# Altium schematic sheet USB2XXX (1).SchDoc
size A3
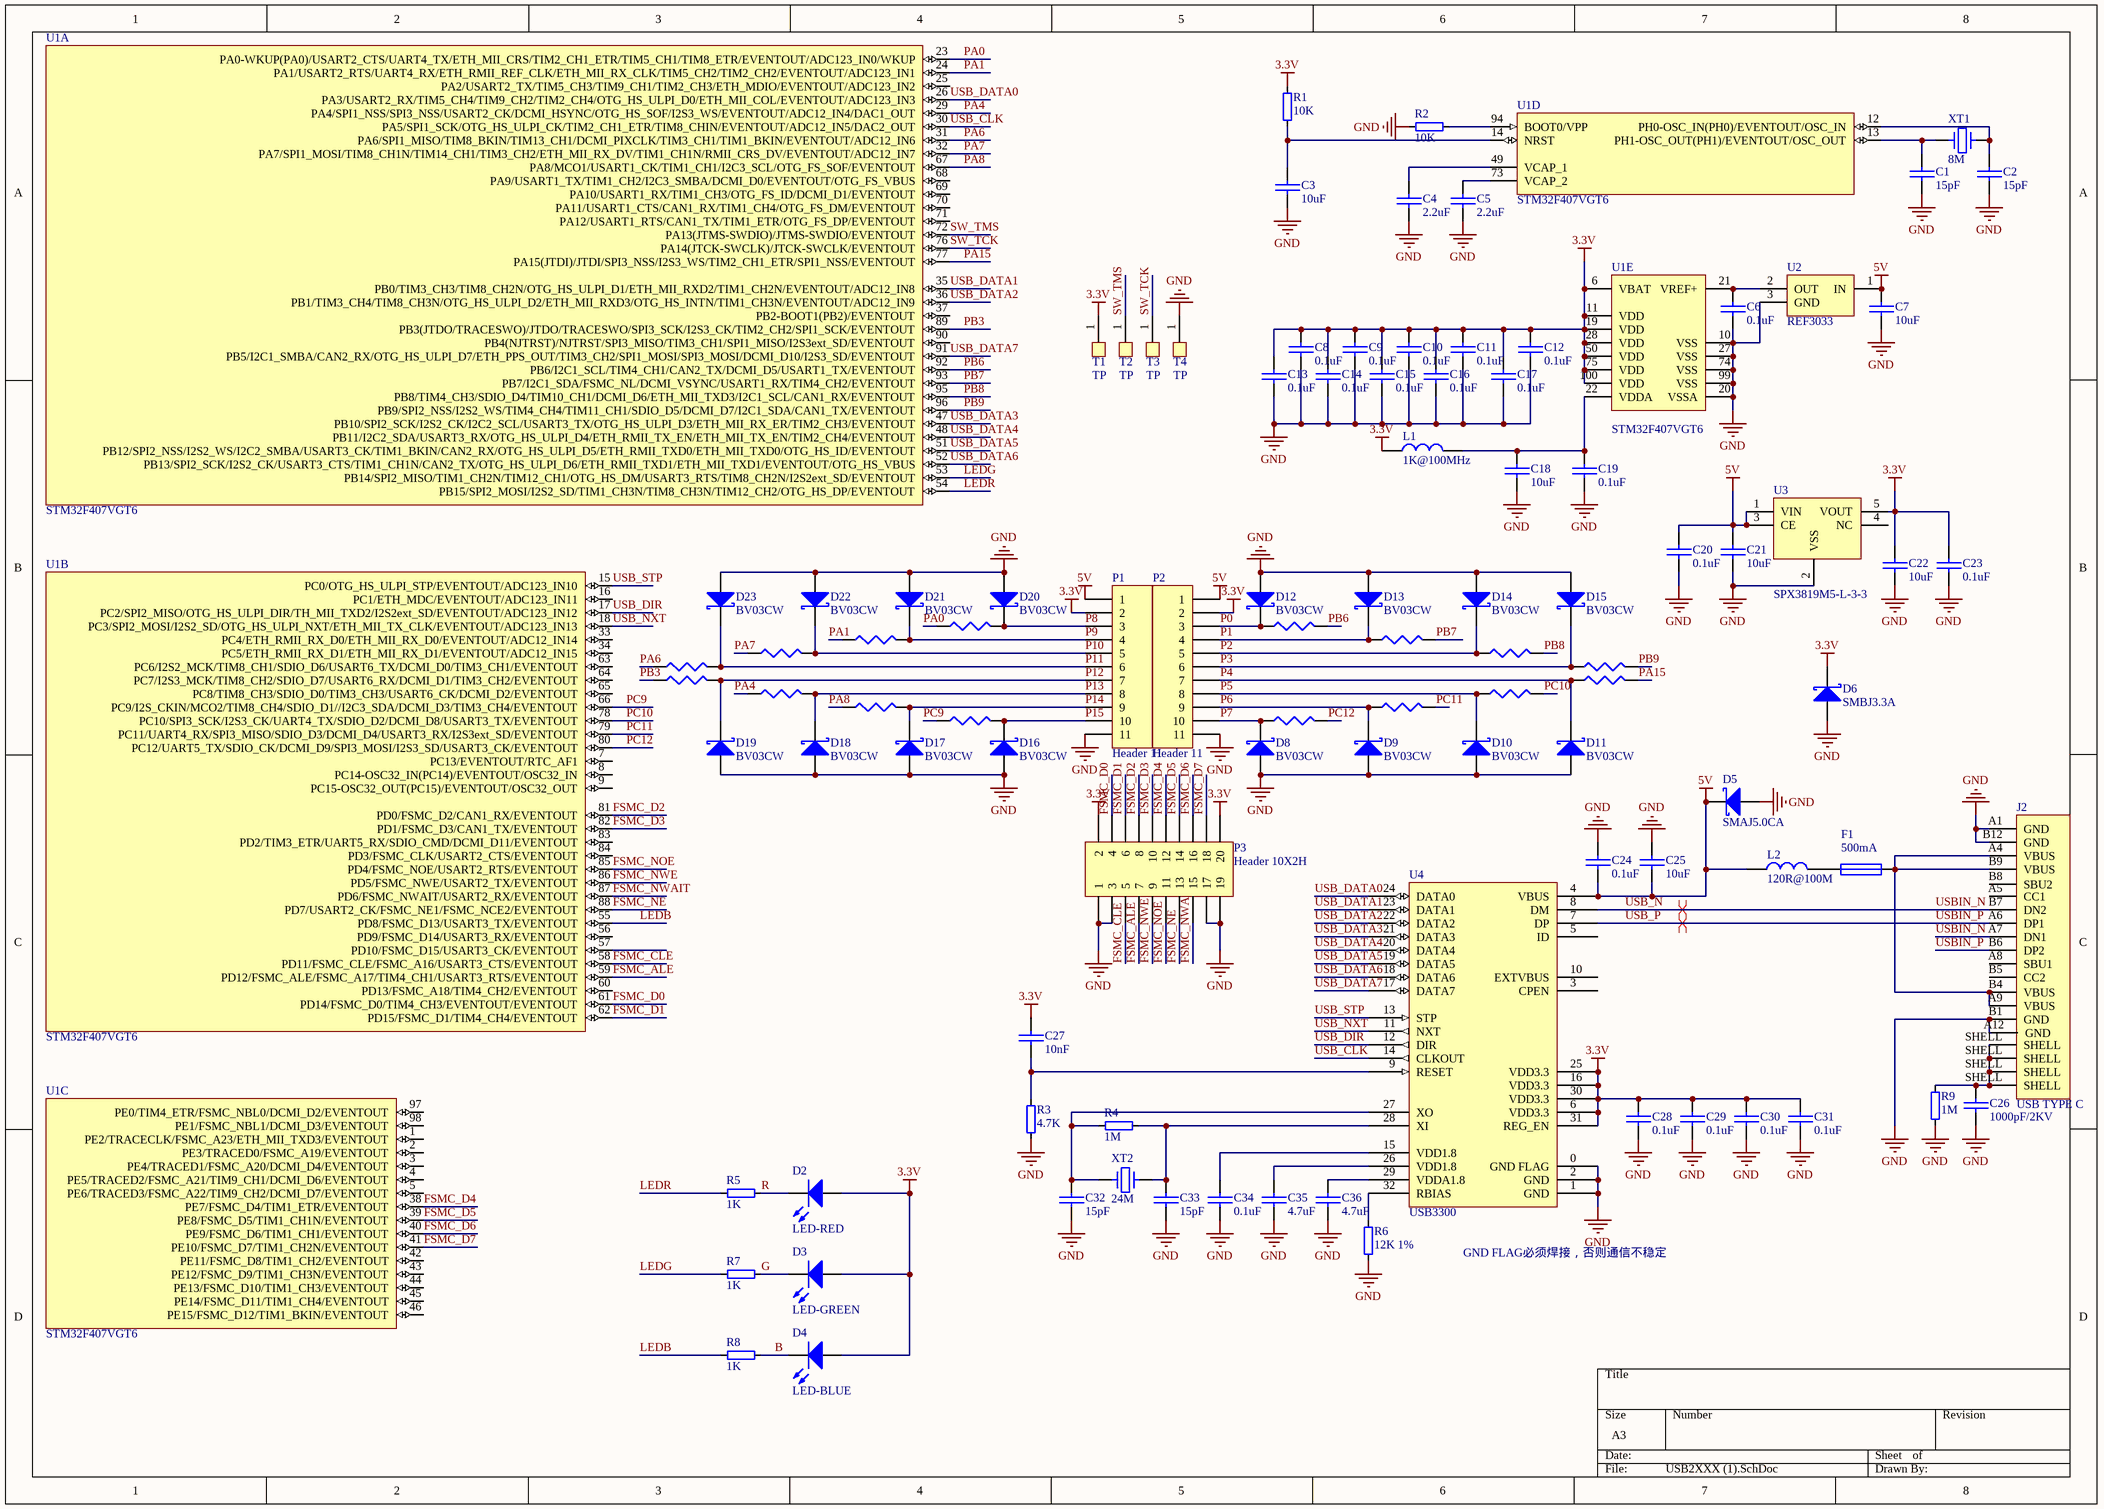
[diagram p0: USB2XXX (1).SchDoc]

## Parts
C1  15pF  [C0402]
C2  15pF  [C0402]
C3  10uF  [C0603]
C4  2.2uF  [C0402]
C5  2.2uF  [C0402]
C6  0.1uF  [C0402]
C7  10uF  [C0603]
C8  0.1uF  [C0402]
C9  0.1uF  [C0402]
C10  0.1uF  [C0402]
C11  0.1uF  [C0402]
C12  0.1uF  [C0402]
C13  0.1uF  [C0402]
C14  0.1uF  [C0402]
C15  0.1uF  [C0402]
C16  0.1uF  [C0402]
C17  0.1uF  [C0402]
C18  10uF  [C0603]
C19  0.1uF  [C0402]
C20  0.1uF  [C0402]
C21  10uF  [C0603]
C22  10uF  [C0603]
C23  0.1uF  [C0402]
C24  0.1uF  [C0402]
C25  10uF  [C0603]
C26  1000pF/2KV  [C1206]
C27  10nF  [C0402]
C28  0.1uF  [C0402]
C29  0.1uF  [C0402]
C30  0.1uF  [C0402]
C31  0.1uF  [C0402]
C32  15pF  [C0402]
C33  15pF  [C0402]
C34  0.1uF  [C0402]
C35  4.7uF  [C0402]
C36  4.7uF  [C0402]
D2  LED-RED  [LED0603R]
D3  LED-GREEN  [LED0603G]
D4  LED-BLUE  [LED0603B]
D5  SMAJ5.0CA  [DO-214AC]
D6  SMBJ3.3A  [DO-214AA]
D8  BV03CW  [SOD323]
D9  BV03CW  [SOD323]
D10  BV03CW  [SOD323]
D11  BV03CW  [SOD323]
D12  BV03CW  [SOD323]
D13  BV03CW  [SOD323]
D14  BV03CW  [SOD323]
D15  BV03CW  [SOD323]
D16  BV03CW  [SOD323]
D17  BV03CW  [SOD323]
D18  BV03CW  [SOD323]
D19  BV03CW  [SOD323]
D20  BV03CW  [SOD323]
D21  BV03CW  [SOD323]
D22  BV03CW  [SOD323]
D23  BV03CW  [SOD323]
F1  500mA  [R0805]
J2  USB TYPE C  [USB3.1_16P]
L1  1K@100MHz  [R0603]
L2  120R@100M  [R0603]
P1  Header 11  [HDR1X11]
P2  Header 11  [HDR1X11]
P3  Header 10X2H  [HDR2X10]
R1  10K  [R0402]
R2  10K  [R0402]
R3  4.7K  [R0402]
R4  1M  [R0402]
R5  1K  [R0402]
R6  12K 1%  [R0402]
R7  1K  [R0402]
R8  1K  [R0402]
R9  1M  [R0402]
R10  0R  [R0402]  (value not drawn)
R11  0R  [R0402]  (value not drawn)
R12  0R  [R0402]  (value not drawn)
R13  0R  [R0402]  (value not drawn)
R14  0R  [R0402]  (value not drawn)
R15  0R  [R0402]  (value not drawn)
R16  0R  [R0402]  (value not drawn)
R17  0R  [R0402]  (value not drawn)
R18  0R  [R0402]  (value not drawn)
R19  0R  [R0402]  (value not drawn)
R20  0R  [R0402]  (value not drawn)
R21  0R  [R0402]  (value not drawn)
R22  0R  [R0402]  (value not drawn)
R23  0R  [R0402]  (value not drawn)
R24  0R  [R0402]  (value not drawn)
R25  0R  [R0402]  (value not drawn)
T1  TP  [TP15]
T2  TP  [TP15]
T3  TP  [TP15]
T4  TP  [TP15]
U1  STM32F407VGT6  [TQFP-100]  (parts A,B,C,D,E of 5)
U2  REF3033  [SOT-23]
U3  SPX3819M5-L-3-3  [SOT23-5]
U4  USB3300  [QFN50P500X500X100-32N]
XT1  8M  [CRYSTAL-SMD-5032]
XT2  24M  [CRYSTAL-SMD-5032]

## Nets
3.3V: C8.2 C9.2 C10.2 C11.2 C12.2 C13.2 C14.2 C15.2 C16.2 C17.2 C22.2 C23.2 C27.2 C28.2 C29.2 C30.2 C31.2 D2.1(A) D3.1(A) D4.1(A) D6.2(K) L1.1 P1.2 P2.2 P3.2 P3.20 R1.2 T1.1 U1.6(VBAT) U1.11(VDD) U1.19(VDD) U1.28(VDD) U1.50(VDD) U1.75(VDD) U1.100(VDD) U3.5(VOUT) U4.6(VDD3.3) U4.16(VDD3.3) U4.25(VDD3.3) U4.30(VDD3.3) U4.31(REG_EN)
5V: C7.2 C20.2 C21.1 C24.1 C25.1 D5.2(K) L2.1 P1.1 P2.1 U2.1(IN) U3.1(VIN) U3.3(CE) U4.4(VBUS)
GND: C1.1 C2.1 C3.1 C4.1 C5.1 C6.1 C7.1 C8.1 C9.1 C10.1 C11.1 C12.1 C13.1 C14.1 C15.1 C16.1 C17.1 C18.1 C19.1 C20.1 C21.2 C22.1 C23.1 C24.2 C25.2 C26.2 C28.1 C29.1 C30.1 C31.1 C32.1 C33.1 C34.1 C35.1 C36.1 D5.1(A) D6.1(A) D8.1(A) D9.1(A) D10.1(A) D11.1(A) D12.1(A) D13.1(A) D14.1(A) D15.1(A) D16.1(A) D17.1(A) D18.1(A) D19.1(A) D20.1(A) D21.1(A) D22.1(A) D23.1(A) J2.A1(GND) J2.A12(GND) J2.B1(GND) J2.B12(GND) P1.11 P2.11 P3.1 P3.3 P3.17 P3.19 R2.1 R3.1 R6.1 R9.1 T4.1 U1.10(VSS) U1.20(VSSA) U1.27(VSS) U1.74(VSS) U1.99(VSS) U2.3(GND) U3.2(VSS) U4.0(GND_FLAG) U4.1(GND) U4.2(GND)
B: D4.2(K) R8.2
FSMC_ALE: P3.7 U1.59(PD12/FSMC_ALE/FSMC_A17/TIM4_CH1/USART3_RTS/EVENTOUT)
FSMC_CLE: P3.5 U1.58(PD11/FSMC_CLE/FSMC_A16/USART3_CTS/EVENTOUT)
FSMC_D0: P3.4 U1.61(PD14/FSMC_D0/TIM4_CH3/EVENTOUT/EVENTOUT)
FSMC_D1: P3.6 U1.62(PD15/FSMC_D1/TIM4_CH4/EVENTOUT)
FSMC_D2: P3.8 U1.81(PD0/FSMC_D2/CAN1_RX/EVENTOUT)
FSMC_D3: P3.10 U1.82(PD1/FSMC_D3/CAN1_TX/EVENTOUT)
FSMC_D4: P3.12 U1.38(PE7/FSMC_D4/TIM1_ETR/EVENTOUT)
FSMC_D5: P3.14 U1.39(PE8/FSMC_D5/TIM1_CH1N/EVENTOUT)
FSMC_D6: P3.16 U1.40(PE9/FSMC_D6/TIM1_CH1/EVENTOUT)
FSMC_D7: P3.18 U1.41(PE10/FSMC_D7/TIM1_CH2N/EVENTOUT)
FSMC_NE: P3.13 U1.88(PD7/USART2_CK/FSMC_NE1/FSMC_NCE2/EVENTOUT)
FSMC_NOE: P3.11 U1.85(PD4/FSMC_NOE/USART2_RTS/EVENTOUT)
FSMC_NWAIT: P3.15 U1.87(PD6/FSMC_NWAIT/USART2_RX/EVENTOUT)
FSMC_NWE: P3.9 U1.86(PD5/FSMC_NWE/USART2_TX/EVENTOUT)
G: D3.2(K) R7.2
LEDB: R8.1 U1.55(PD8/FSMC_D13/USART3_TX/EVENTOUT)
LEDG: R7.1 U1.53(PB14/SPI2_MISO/TIM1_CH2N/TIM12_CH1/OTG_HS_DM/USART3_RTS/TIM8_CH2N/I2S2ext_SD/EVENTOUT)
LEDR: R5.1 U1.54(PB15/SPI2_MOSI/I2S2_SD/TIM1_CH3N/TIM8_CH3N/TIM12_CH2/OTG_HS_DP/EVENTOUT)
P0: D12.2(K) P2.3 R18.1
P1: D13.2(K) P2.4 R19.1
P2: D14.2(K) P2.5 R20.1
P3: D15.2(K) P2.6 R21.1
P4: D11.2(K) P2.7 R22.1
P5: D10.2(K) P2.8 R23.1
P6: D9.2(K) P2.9 R24.1
P7: D8.2(K) P2.10 R25.1
P8: D20.2(K) P1.3 R10.2
P9: D21.2(K) P1.4 R11.2
P10: D22.2(K) P1.5 R12.2
P11: D23.2(K) P1.6 R13.2
P12: D19.2(K) P1.7 R14.2
P13: D18.2(K) P1.8 R15.2
P14: D17.2(K) P1.9 R16.2
P15: D16.2(K) P1.10 R17.2
PA0: R10.1 U1.23(PA0-WKUP(PA0)/USART2_CTS/UART4_TX/ETH_MII_CRS/TIM2_CH1_ETR/TIM5_CH1/TIM8_ETR/EVENTOUT/ADC123_IN0/WKUP)
PA1: R11.1 U1.24(PA1/USART2_RTS/UART4_RX/ETH_RMII_REF_CLK/ETH_MII_RX_CLK/TIM5_CH2/TIM2_CH2/EVENTOUT/ADC123_IN1)
PA4: R15.1 U1.29(PA4/SPI1_NSS/SPI3_NSS/USART2_CK/DCMI_HSYNC/OTG_HS_SOF/I2S3_WS/EVENTOUT/ADC12_IN4/DAC1_OUT)
PA6: R13.1 U1.31(PA6/SPI1_MISO/TIM8_BKIN/TIM13_CH1/DCMI_PIXCLK/TIM3_CH1/TIM1_BKIN/EVENTOUT/ADC12_IN6)
PA7: R12.1 U1.32(PA7/SPI1_MOSI/TIM8_CH1N/TIM14_CH1/TIM3_CH2/ETH_MII_RX_DV/TIM1_CH1N/RMII_CRS_DV/EVENTOUT/ADC12_IN7)
PA8: R16.1 U1.67(PA8/MCO1/USART1_CK/TIM1_CH1/I2C3_SCL/OTG_FS_SOF/EVENTOUT)
PA15: R22.2 U1.77(PA15(JTDI)/JTDI/SPI3_NSS/I2S3_WS/TIM2_CH1_ETR/SPI1_NSS/EVENTOUT)
PB3: R14.1 U1.89(PB3(JTDO/TRACESWO)/JTDO/TRACESWO/SPI3_SCK/I2S3_CK/TIM2_CH2/SPI1_SCK/EVENTOUT)
PB6: R18.2 U1.92(PB6/I2C1_SCL/TIM4_CH1/CAN2_TX/DCMI_D5/USART1_TX/EVENTOUT)
PB7: R19.2 U1.93(PB7/I2C1_SDA/FSMC_NL/DCMI_VSYNC/USART1_RX/TIM4_CH2/EVENTOUT)
PB8: R20.2 U1.95(PB8/TIM4_CH3/SDIO_D4/TIM10_CH1/DCMI_D6/ETH_MII_TXD3/I2C1_SCL/CAN1_RX/EVENTOUT)
PB9: R21.2 U1.96(PB9/SPI2_NSS/I2S2_WS/TIM4_CH4/TIM11_CH1/SDIO_D5/DCMI_D7/I2C1_SDA/CAN1_TX/EVENTOUT)
PC9: R17.1 U1.66(PC9/I2S_CKIN/MCO2/TIM8_CH4/SDIO_D1//I2C3_SDA/DCMI_D3/TIM3_CH4/EVENTOUT)
PC10: R23.2 U1.78(PC10/SPI3_SCK/I2S3_CK/UART4_TX/SDIO_D2/DCMI_D8/USART3_TX/EVENTOUT)
PC11: R24.2 U1.79(PC11/UART4_RX/SPI3_MISO/SDIO_D3/DCMI_D4/USART3_RX/I2S3ext_SD/EVENTOUT)
PC12: R25.2 U1.80(PC12/UART5_TX/SDIO_CK/DCMI_D9/SPI3_MOSI/I2S3_SD/USART3_CK/EVENTOUT)
R: D2.2(K) R5.2
SW_TCK: T3.1 U1.76(PA14(JTCK-SWCLK)/JTCK-SWCLK/EVENTOUT)
SW_TMS: T2.1 U1.72(PA13(JTMS-SWDIO)/JTMS-SWDIO/EVENTOUT)
USB_CLK: U1.30(PA5/SPI1_SCK/OTG_HS_ULPI_CK/TIM2_CH1_ETR/TIM8_CHIN/EVENTOUT/ADC12_IN5/DAC2_OUT) U4.14(CLKOUT)
USB_DATA0: U1.26(PA3/USART2_RX/TIM5_CH4/TIM9_CH2/TIM2_CH4/OTG_HS_ULPI_D0/ETH_MII_COL/EVENTOUT/ADC123_IN3) U4.24(DATA0)
USB_DATA1: U1.35(PB0/TIM3_CH3/TIM8_CH2N/OTG_HS_ULPI_D1/ETH_MII_RXD2/TIM1_CH2N/EVENTOUT/ADC12_IN8) U4.23(DATA1)
USB_DATA2: U1.36(PB1/TIM3_CH4/TIM8_CH3N/OTG_HS_ULPI_D2/ETH_MII_RXD3/OTG_HS_INTN/TIM1_CH3N/EVENTOUT/ADC12_IN9) U4.22(DATA2)
USB_DATA3: U1.47(PB10/SPI2_SCK/I2S2_CK/I2C2_SCL/USART3_TX/OTG_HS_ULPI_D3/ETH_MII_RX_ER/TIM2_CH3/EVENTOUT) U4.21(DATA3)
USB_DATA4: U1.48(PB11/I2C2_SDA/USART3_RX/OTG_HS_ULPI_D4/ETH_RMII_TX_EN/ETH_MII_TX_EN/TIM2_CH4/EVENTOUT) U4.20(DATA4)
USB_DATA5: U1.51(PB12/SPI2_NSS/I2S2_WS/I2C2_SMBA/USART3_CK/TIM1_BKIN/CAN2_RX/OTG_HS_ULPI_D5/ETH_RMII_TXD0/ETH_MII_TXD0/OTG_HS_ID/EVENTOUT) U4.19(DATA5)
USB_DATA6: U1.52(PB13/SPI2_SCK/I2S2_CK/USART3_CTS/TIM1_CH1N/CAN2_TX/OTG_HS_ULPI_D6/ETH_RMII_TXD1/ETH_MII_TXD1/EVENTOUT/OTG_HS_VBUS) U4.18(DATA6)
USB_DATA7: U1.91(PB5/I2C1_SMBA/CAN2_RX/OTG_HS_ULPI_D7/ETH_PPS_OUT/TIM3_CH2/SPI1_MOSI/SPI3_MOSI/DCMI_D10/I2S3_SD/EVENTOUT) U4.17(DATA7)
USB_DIR: U1.17(PC2/SPI2_MISO/OTG_HS_ULPI_DIR/TH_MII_TXD2/I2S2ext_SD/EVENTOUT/ADC123_IN12) U4.12(DIR)
USB_N: J2.A7(DN1) J2.B7(DN2) U4.8(DM)  [also labelled USBIN_N]
USB_NXT: U1.18(PC3/SPI2_MOSI/I2S2_SD/OTG_HS_ULPI_NXT/ETH_MII_TX_CLK/EVENTOUT/ADC123_IN13) U4.11(NXT)
USB_P: J2.A6(DP1) J2.B6(DP2) U4.7(DP)  [also labelled USBIN_P]
USB_STP: U1.15(PC0/OTG_HS_ULPI_STP/EVENTOUT/ADC123_IN10) U4.13(STP)
NetC1_2: C1.2 U1.13(PH1-OSC_OUT(PH1)/EVENTOUT/OSC_OUT) XT1.1
NetC2_2: C2.2 U1.12(PH0-OSC_IN(PH0)/EVENTOUT/OSC_IN) XT1.2
NetC3_2: C3.2 R1.1 U1.14(NRST)
NetC4_2: C4.2 U1.49(VCAP_1)
NetC5_2: C5.2 U1.73(VCAP_2)
NetC6_2: C6.2 U1.21(VREF+) U2.2(OUT)
NetC18_2: C18.2 C19.2 L1.2 U1.22(VDDA)
NetC26_1: C26.1 J2.SHELL R9.2
NetC27_1: C27.1 R3.2 U4.9(RESET)
NetC32_2: C32.2 R4.1 U4.27(XO) XT2.1
NetC33_2: C33.2 R4.2 U4.28(XI) XT2.2
NetC34_2: C34.2 U4.15(VDD1.8)
NetC35_2: C35.2 U4.26(VDD1.8)
NetC36_2: C36.2 U4.29(VDDA1.8)
NetF1_1: F1.1 L2.2
NetF1_2: F1.2 J2.A4(VBUS) J2.A9(VBUS) J2.B4(VBUS) J2.B9(VBUS)
NetR2_2: R2.2 U1.94(BOOT0/VPP)
NetR6_2: R6.2 U4.32(RBIAS)

Not connected (* = marked no-connect by the designer): J2 A5(CC1) A8(SBU1) B5(CC2) B8(SBU2); U1 1(PE2/TRACECLK/FSMC_A23/ETH_MII_TXD3/EVENTOUT) 2(PE3/TRACED0/FSMC_A19/EVENTOUT) 3(PE4/TRACED1/FSMC_A20/DCMI_D4/EVENTOUT) 4(PE5/TRACED2/FSMC_A21/TIM9_CH1/DCMI_D6/EVENTOUT) 5(PE6/TRACED3/FSMC_A22/TIM9_CH2/DCMI_D7/EVENTOUT) 7(PC13/EVENTOUT/RTC_AF1) 8(PC14-OSC32_IN(PC14)/EVENTOUT/OSC32_IN) 9(PC15-OSC32_OUT(PC15)/EVENTOUT/OSC32_OUT) 16(PC1/ETH_MDC/EVENTOUT/ADC123_IN11) 25(PA2/USART2_TX/TIM5_CH3/TIM9_CH1/TIM2_CH3/ETH_MDIO/EVENTOUT/ADC123_IN2) 33(PC4/ETH_RMII_RX_D0/ETH_MII_RX_D0/EVENTOUT/ADC12_IN14) 34(PC5/ETH_RMII_RX_D1/ETH_MII_RX_D1/EVENTOUT/ADC12_IN15) 37(PB2-BOOT1(PB2)/EVENTOUT) 42(PE11/FSMC_D8/TIM1_CH2/EVENTOUT) 43(PE12/FSMC_D9/TIM1_CH3N/EVENTOUT) 44(PE13/FSMC_D10/TIM1_CH3/EVENTOUT) 45(PE14/FSMC_D11/TIM1_CH4/EVENTOUT) 46(PE15/FSMC_D12/TIM1_BKIN/EVENTOUT) 56(PD9/FSMC_D14/USART3_RX/EVENTOUT) 57(PD10/FSMC_D15/USART3_CK/EVENTOUT) 60(PD13/FSMC_A18/TIM4_CH2/EVENTOUT) 63(PC6/I2S2_MCK/TIM8_CH1/SDIO_D6/USART6_TX/DCMI_D0/TIM3_CH1/EVENTOUT) 64(PC7/I2S3_MCK/TIM8_CH2/SDIO_D7/USART6_RX/DCMI_D1/TIM3_CH2/EVENTOUT) 65(PC8/TIM8_CH3/SDIO_D0/TIM3_CH3/USART6_CK/DCMI_D2/EVENTOUT) 68(PA9/USART1_TX/TIM1_CH2/I2C3_SMBA/DCMI_D0/EVENTOUT/OTG_FS_VBUS) 69(PA10/USART1_RX/TIM1_CH3/OTG_FS_ID/DCMI_D1/EVENTOUT) 70(PA11/USART1_CTS/CAN1_RX/TIM1_CH4/OTG_FS_DM/EVENTOUT) 71(PA12/USART1_RTS/CAN1_TX/TIM1_ETR/OTG_FS_DP/EVENTOUT) 83(PD2/TIM3_ETR/UART5_RX/SDIO_CMD/DCMI_D11/EVENTOUT) 84(PD3/FSMC_CLK/USART2_CTS/EVENTOUT) 90(PB4(NJTRST)/NJTRST/SPI3_MISO/TIM3_CH1/SPI1_MISO/I2S3ext_SD/EVENTOUT) 97(PE0/TIM4_ETR/FSMC_NBL0/DCMI_D2/EVENTOUT) 98(PE1/FSMC_NBL1/DCMI_D3/EVENTOUT); U3 4(NC); U4 3(CPEN) 5(ID) 10(EXTVBUS)

## Layout directives
differential pair: USB_N, USB_P

## Notes on the sheet
- GND FLAG必须焊接，否则通信不稳定

## Library data of the parts
C1-C36 = Capacitor
D2-D4 = LED
D5 D6 D8-D23 = Diode Schottky
F1 = FUSE1: FUSE
J2 = USB_TYPE_C
L1 L2 = Inductor
P1 P2 = Header 11: Header, 11-Pin; LatestRevisionDate: 17-Jul-2002; LatestRevisionNote: Re-released for DXP Platform.; Publisher: Altium Limited
P3 = Header 10X2H: Header, 10-Pin, Dual row, Right Angle; LatestRevisionDate: 17-Jul-2002; LatestRevisionNote: Re-released for DXP Platform.; Publisher: Altium Limited
R1-R9 = R-10K: resistor
R10-R25 = Resistance
U1 = STM32F407VGT6: ARM Cortex-M4 32b MCU+FPU, 210DMIP, 1024 kB Flash, 192+4 kB RAM, Camera, 82 I/Os, 100-pin LQFP, -40 to +85癈, Tray; Internal RAM: 192kB; Operating Frequency (Processor Speed): 168MHz; A/D Converter: 16x12-bit; D/A Converter: 2x12-bit; 16-bit Timers (IC/OC/PWM): 12x16-bit(24/24/30); 32-bit Timer (IC/OC/PWM): 2x32-bit (8/8/8); Other Timer Functions: 2xWDG, RTC, 24-bit down counter; Serial Interface: 3xSPI/2xI2S/2xI2C/3xUSART(IrDa, ISO7816)/3xUART/2xUSB OTG FS/HS, 2xCAN/Ethernet MAC10/100, SDIO; DatasheetVersion: rev2, Jan-2012; PackageVersion: 2012; PackageReference: LQFP100; PackageDescription: 100-Pin Low Profile Quad Flat Package, 14x14 mm Body, 0.5 mm Pitch; ComponentLink1Description: Manufacturer URL; ComponentLink1URL: http://www.st.com/; ComponentLink2Description: STM32F405/7 Datasheet; ComponentLink2URL: http://www.st.com/internet/com/TECHNICAL_RESOURCES/TECHNICAL_LITERATURE/DATASHEET/DM00037051.pdf; ComponentLink3Description: STM32F4 Web Page; ComponentLink3URL: http://www.st.com/internet/mcu/subclass/1521.jsp
U2 = REF33XX
U3 = ME6211
XT1 XT2 = XT: 晶振